# EAGLE design pedal (EAGLE 9.6.2)
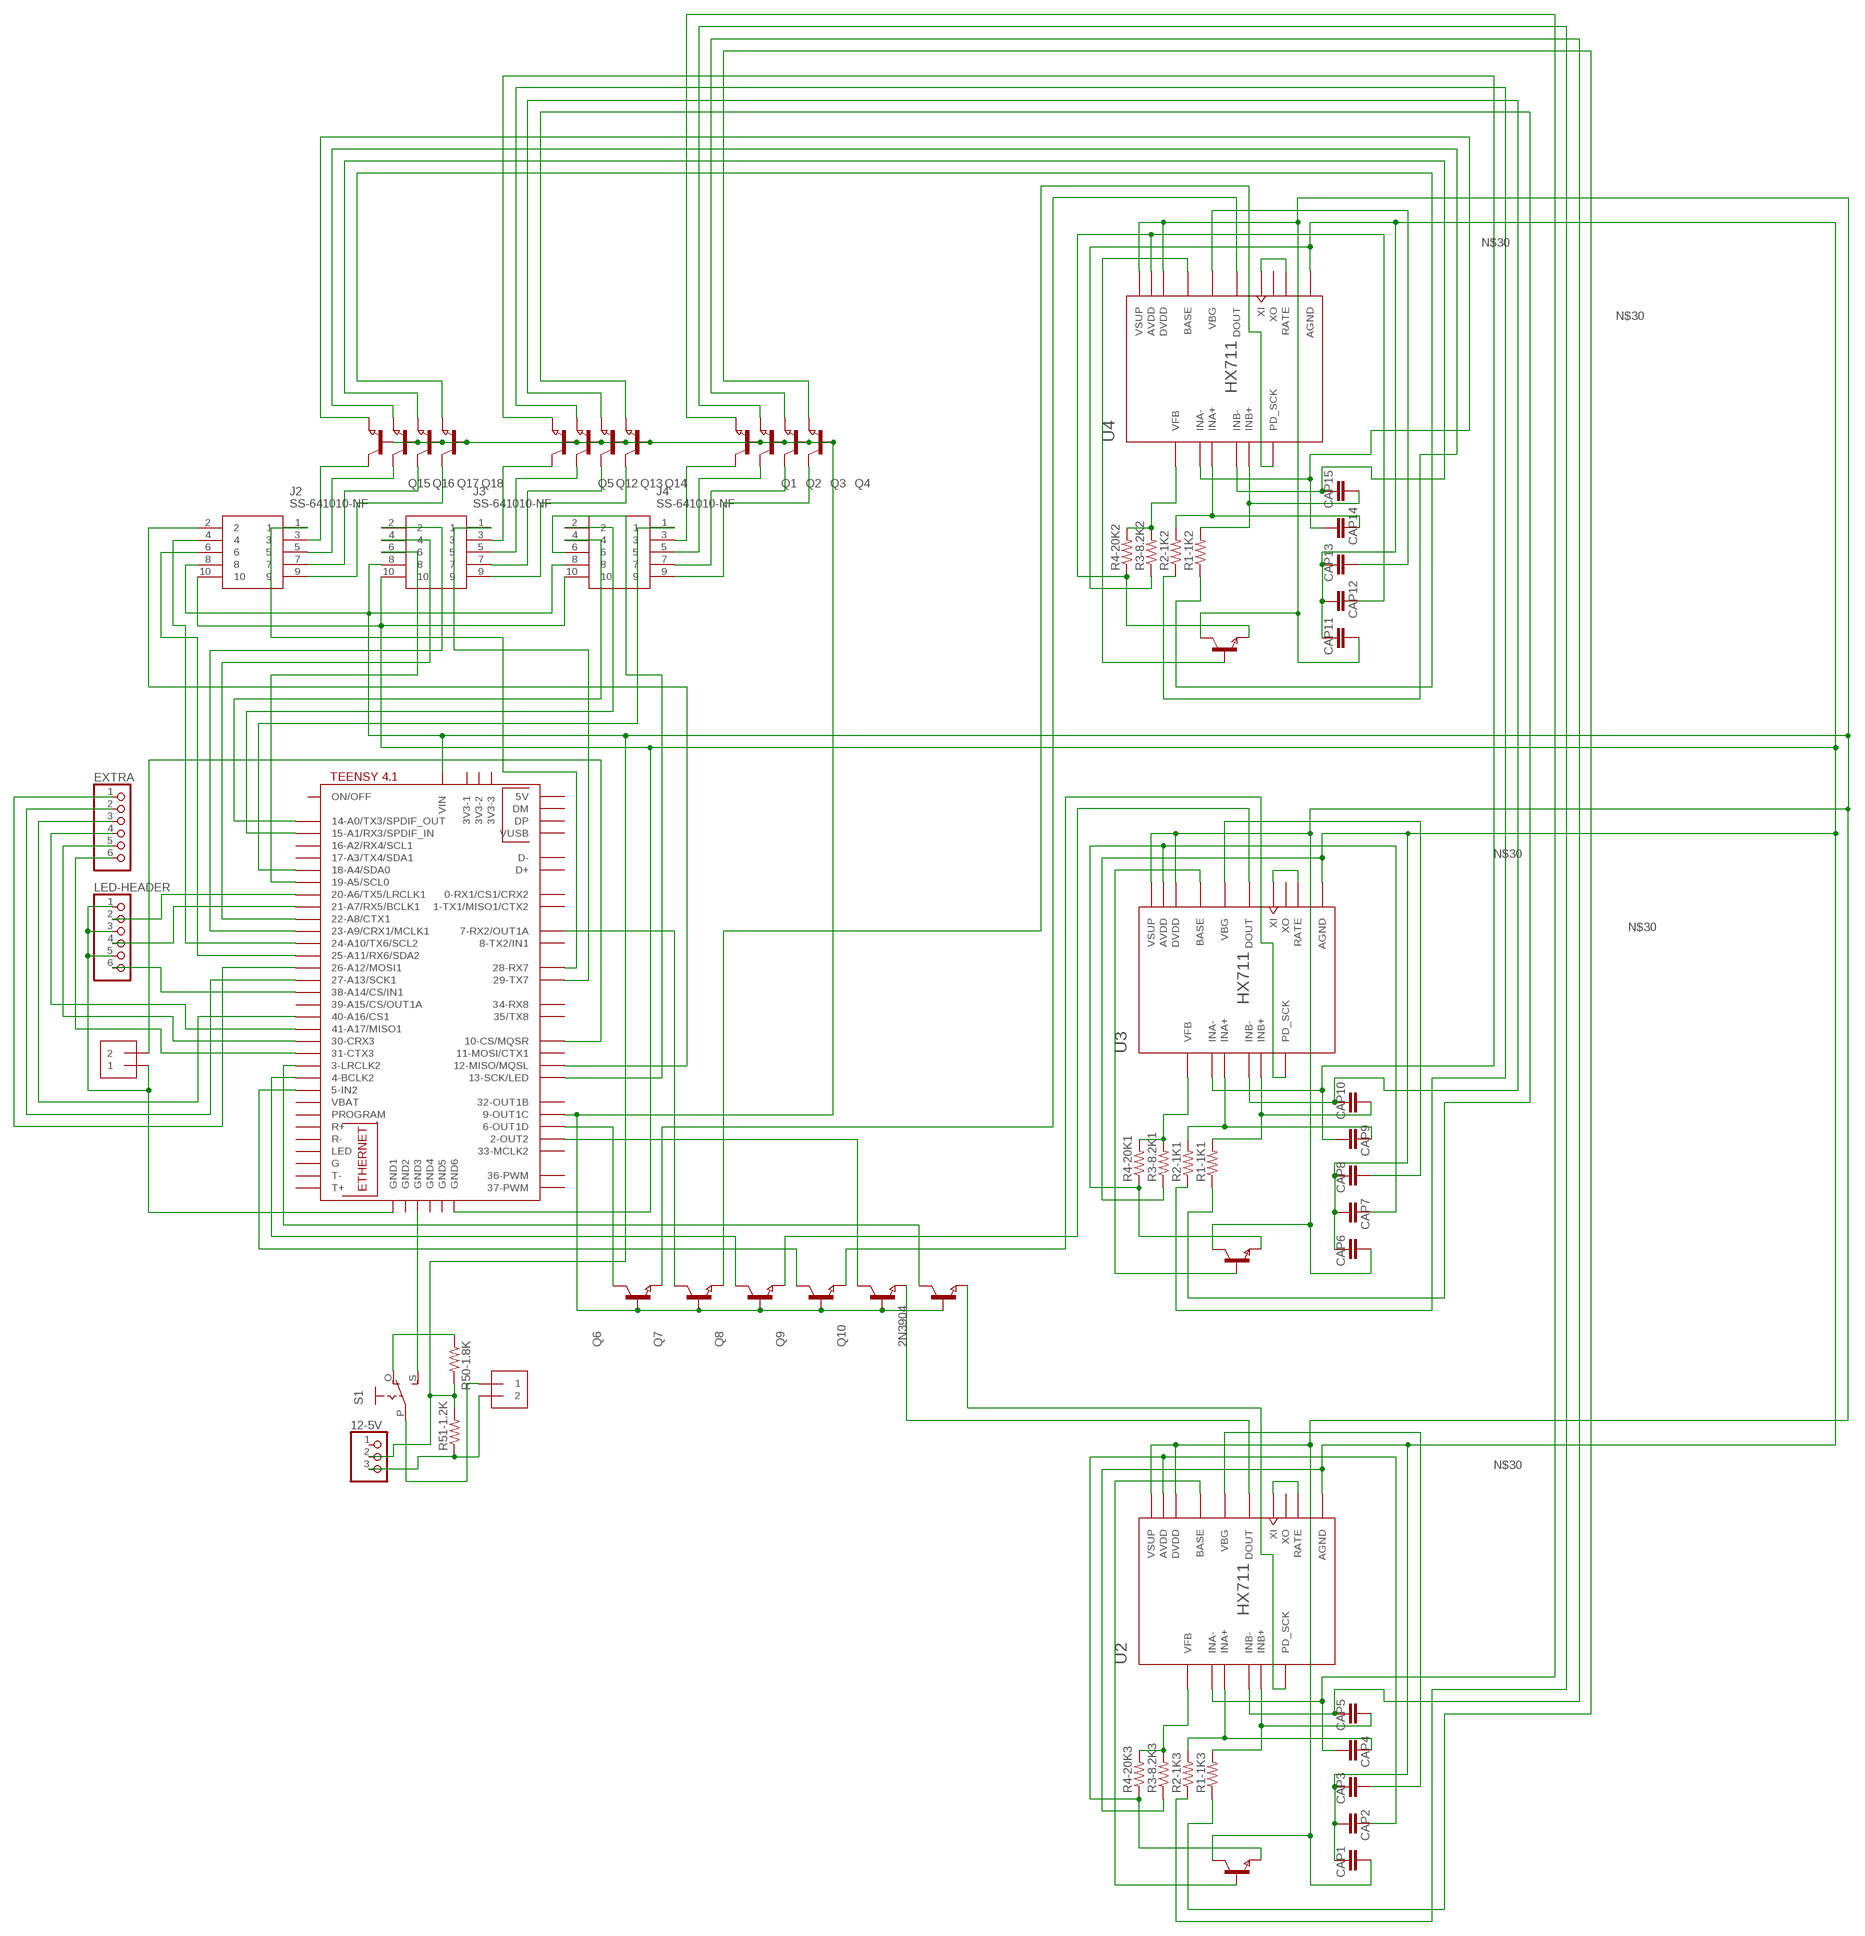
[diagram p0: schematic, sheet 1]

## Parts
2N3904  NPN-TRANSISTOR_SOT23  [SOT23]
12-5V  PINHD-1X3  [1X03]
CAP1  1uf  10NF-0603-50V-10%  [0603]
CAP2  1uf  10NF-0603-50V-10%  [0603]
CAP3  1uf  10NF-0603-50V-10%  [0603]
CAP4  .1uf  10NF-0603-50V-10%  [0603]
CAP5  .1uf  10NF-0603-50V-10%  [0603]
CAP6  1uf  10NF-0603-50V-10%  [0603]
CAP7  1uf  10NF-0603-50V-10%  [0603]
CAP8  1uf  10NF-0603-50V-10%  [0603]
CAP9  .1uf  10NF-0603-50V-10%  [0603]
CAP10  .1uf  10NF-0603-50V-10%  [0603]
CAP11  1uf  10NF-0603-50V-10%  [0603]
CAP12  1uf  10NF-0603-50V-10%  [0603]
CAP13  1uf  10NF-0603-50V-10%  [0603]
CAP14  .1uf  10NF-0603-50V-10%  [0603]
CAP15  .1uf  10NF-0603-50V-10%  [0603]
E-STOP  1X2-3.5MM  [1X2-3.5MM]
EXTRA  PINHD-1X6B  [1X06-BIG]
J2  SS-641010-NF  [SS-641010-NF]
J3  SS-641010-NF  [SS-641010-NF]
J4  SS-641010-NF  [SS-641010-NF]
LED-HEADER  PINHD-1X6B  [1X06-BIG]
POWER-IN  1X2-3.5MM  [1X2-3.5MM]
Q1  NPN-TRANSISTOR_SOT23  [SOT23]
Q2  NPN-TRANSISTOR_SOT23  [SOT23]
Q3  NPN-TRANSISTOR_SOT23  [SOT23]
Q4  NPN-TRANSISTOR_SOT23  [SOT23]
Q5  NPN-TRANSISTOR_SOT23  [SOT23]
Q6  NPN-TRANSISTOR_SOT23  [SOT23]
Q7  NPN-TRANSISTOR_SOT23  [SOT23]
Q8  NPN-TRANSISTOR_SOT23  [SOT23]
Q9  NPN-TRANSISTOR_SOT23  [SOT23]
Q10  NPN-TRANSISTOR_SOT23  [SOT23]
Q12  NPN-TRANSISTOR_SOT23  [SOT23]
Q13  NPN-TRANSISTOR_SOT23  [SOT23]
Q14  NPN-TRANSISTOR_SOT23  [SOT23]
Q15  NPN-TRANSISTOR_SOT23  [SOT23]
Q16  NPN-TRANSISTOR_SOT23  [SOT23]
Q17  NPN-TRANSISTOR_SOT23  [SOT23]
Q18  NPN-TRANSISTOR_SOT23  [SOT23]
R1-1K1  R-US_R0603  [R0603]
R1-1K2  R-US_R0603  [R0603]
R1-1K3  R-US_R0603  [R0603]
R2-1K1  R-US_R0603  [R0603]
R2-1K2  R-US_R0603  [R0603]
R2-1K3  R-US_R0603  [R0603]
R3-8.2K1  R-US_R0603  [R0603]
R3-8.2K2  R-US_R0603  [R0603]
R3-8.2K3  R-US_R0603  [R0603]
R4-20K1  R-US_R0603  [R0603]
R4-20K2  R-US_R0603  [R0603]
R4-20K3  R-US_R0603  [R0603]
R50-1.8K  R-US_R0603  [R0603]
R51-1.2K  R-US_R0603  [R0603]
S1  EG1218S  [EG1218]
T1  8550  FMMT451  [SOT-23]
T2  8550  FMMT451  [SOT-23]
T3  8550  FMMT451  [SOT-23]
U2  HX711  [SOP127P600X180-16N]
U3  HX711  [SOP127P600X180-16N]
U4  HX711  [SOP127P600X180-16N]
U$5  TEENSY41  [TEENSY41]

## Nets
N$1: CAP5.2 R1-1K3.2 U2.10(INB+)
N$2: CAP10.2 R1-1K1.2 U3.10(INB+)
N$3: CAP5.1 Q3.2(E) U2.9(INB-)
N$4: Q4.2(E) R1-1K3.1
N$5: CAP4.2 R2-1K3.2 U2.8(INA+)
N$6: 2N3904.1(B) Q1.1(B) Q2.1(B) Q3.1(B) Q4.1(B) Q5.1(B) Q6.1(B) Q7.1(B) Q8.1(B) Q9.1(B) Q10.1(B) Q12.1(B) Q13.1(B) Q14.1(B) Q15.1(B) Q16.1(B) Q17.1(B) Q18.1(B) U$5.9-OUT1C
N$7: Q2.2(E) R2-1K3.1
N$8: CAP3.2 U2.6(VBG)
N$9: R3-8.2K3.2 R4-20K3.2 U2.4(VFB)
N$10: 2N3904.2(E) U2.11(PD_SCK)
N$11: T1.3(B) U2.2(BASE)
N$12: U2.14(XI) U2.15(RATE)
N$13: Q10.2(E) U2.12(DOUT)
N$14: CAP10.1 Q13.2(E) U3.9(INB-)
N$15: Q14.2(E) R1-1K1.1
N$16: CAP2.2 R4-20K3.1 T1.2(E) U2.3(AVDD)
N$17: Q10.3(C) U$5.2-OUT2
N$18: 2N3904.3(C) U$5.3-LRCLK2
N$19: CAP9.2 R2-1K1.2 U3.8(INA+)
N$20: Q12.2(E) R2-1K1.1
N$21: CAP8.2 U3.6(VBG)
N$22: R3-8.2K1.2 R4-20K1.2 U3.4(VFB)
N$23: T2.3(B) U3.2(BASE)
N$24: U3.14(XI) U3.15(RATE)
N$25: Q9.3(C) U$5.5-IN2
N$26: CAP7.2 R4-20K1.1 T2.2(E) U3.3(AVDD)
N$27: Q8.2(E) U3.12(DOUT)
N$28: Q9.2(E) U3.11(PD_SCK)
N$29: Q7.3(C) U$5.7-RX2/OUT1A
N$30: CAP1.1 CAP2.1 CAP3.1 CAP6.1 CAP7.1 CAP8.1 CAP11.1 CAP12.1 CAP13.1 J2.10 J3.10 J4.10 R3-8.2K1.1 R3-8.2K2.1 R3-8.2K3.1 U2.5(AGND) U3.5(AGND) U4.5(AGND) U$5.GND6
N$31: Q8.3(C) U$5.4-BCLK2
N$32: CAP9.1 Q5.2(E) U3.7(INA-)
N$33: Q6.3(C) U$5.6-OUT1D
N$34: CAP4.1 Q1.2(E) U2.7(INA-)
N$35: E-STOP.2 U$5.10-CS\MQSR(10-CS/MQSR)
N$36: J4.6 U$5.13-SCK/LED
N$37: E-STOP.1 LED-HEADER.1 LED-HEADER.3 LED-HEADER.5 U$5.GND1
N$38: LED-HEADER.2 U$5.20-A6/TX5/LRCLK1
N$39: 12-5V.2 CAP1.2 CAP6.2 CAP11.2 J2.8 J3.8 J4.8 R50-1.8K.2 R51-1.2K.2 T1.1(C) T2.1(C) T3.1(C) U2.1(VSUP) U2.16(DVDD) U3.1(VSUP) U3.16(DVDD) U4.1(VSUP) U4.16(DVDD) U$5.VIN
N$40: LED-HEADER.4 U$5.21-A7/RX5/BCLK1
N$41: LED-HEADER.6 U$5.38-A14/CS/IN1
N$42: J4.4 U$5.14-A0/TX3/SPDIF_OUT
N$43: J4.2 U$5.15-A1/RX3/SPDIF_IN
N$44: J4.1 U$5.18-A4/SDA0
N$45: J3.6 U$5.19-A5/SCL0
N$46: J3.4 U$5.22-A8/CTX1
N$47: J3.2 U$5.23-A9/CRX1/MCLK1
N$48: J3.1 U$5.29-TX7
N$49: EXTRA.6 U$5.31-CTX3
N$50: CAP15.2 R1-1K2.2 U4.10(INB+)
N$51: CAP15.1 Q17.2(E) U4.9(INB-)
N$52: POWER-IN.1 S1.P
N$53: S1.S U$5.GND3
N$54: 12-5V.3 POWER-IN.2 R51-1.2K.1
N$55: Q18.2(E) R1-1K2.1
N$56: J2.1 U$5.28-RX7
N$57: R50-1.8K.1 S1.O
N$58: CAP14.2 R2-1K2.2 U4.8(INA+)
N$59: J2.6 U$5.25-A11/RX6/SDA2
N$60: J2.4 U$5.24-A10/TX6/SCL2
N$61: Q16.2(E) R2-1K2.1
N$62: EXTRA.5 U$5.30-CRX3
N$63: J2.2 U$5.12-MISO/MQSL
N$64: CAP13.2 U4.6(VBG)
N$65: R3-8.2K2.2 R4-20K2.2 U4.4(VFB)
N$66: T3.3(B) U4.2(BASE)
N$67: U4.14(XI) U4.15(RATE)
N$68: CAP12.2 R4-20K2.1 T3.2(E) U4.3(AVDD)
N$69: Q6.2(E) U4.12(DOUT)
N$70: Q7.2(E) U4.11(PD_SCK)
N$71: EXTRA.4 U$5.41-A17/MISO1
N$72: EXTRA.3 U$5.40-A16/CS1
N$73: EXTRA.2 U$5.27-A13/SCK1
N$74: CAP14.1 Q15.2(E) U4.7(INA-)
N$75: EXTRA.1 U$5.26-A12/MOSI1
N$76: J2.7 Q17.3(C)
N$77: J2.5 Q16.3(C)
N$78: J2.3 Q15.3(C)
N$79: J3.7 Q13.3(C)
N$80: J3.5 Q12.3(C)
N$81: J2.9 Q18.3(C)
N$82: J3.3 Q5.3(C)
N$83: J4.7 Q3.3(C)
N$84: J4.5 Q2.3(C)
N$85: J4.3 Q1.3(C)
N$86: J3.9 Q14.3(C)
N$90: J4.9 Q4.3(C)
Unconnected: 12-5V.1 U2.13(XO) U3.13(XO) U4.13(XO) U$5.0-RX1/CS1/CRX2 U$5.1-TX1/MISO1/CTX2 U$5.3V3-1 U$5.3V3-2 U$5.3V3-3 U$5.8-TX2/IN1 U$5.11-MOSI/CTX1 U$5.16-A2/RX4/SCL1 U$5.17-A3/TX4/SDA1 U$5.32-OUT1B U$5.33-MCLK2 U$5.34-RX8 U$5.35-TX8(35/TX8) U$5.36-PWM U$5.37-PWM U$5.39-A15/CS/OUT1A U$5.+5V(5V) U$5.D+ U$5.D- U$5.DM U$5.DP U$5.G U$5.GND2 U$5.GND4 U$5.GND5 U$5.LED U$5.ON/OFF U$5.PROGRAM U$5.R+ U$5.R- U$5.T+ U$5.T- U$5.VBAT U$5.VUSB

## Library data of the parts
2N3904 Q1-Q10 Q12-Q18 = semicon-smd-ipc:NPN-TRANSISTOR_: NPN TRANSISTOR
12-5V = adafruit:PINHD-1X3: PIN HEADER
CAP1-CAP15 = SparkFun-Capacitors:10NF: 0.01uF/10nF/10,000pF ceramic capacitors A capacitor is a passive two-terminal electrical component used to store electrical energy temporarily in an electric field. CAP-09321; PROD_ID: CAP-00867; VALUE: 10nF
E-STOP POWER-IN = adafruit:1X2: 3.5mm Terminal block http://www.ladyada.net/library/pcb/eaglelibrary.html
EXTRA LED-HEADER = adafruit:PINHD-1X6: PIN HEADER
J2-J4 = SS-641010-NF:SS-641010-NF: Bel-Stewart 10P10C Right Angle RJ50 Connector, Through Hole Source: Datasheet <http://uk.rs-online.com/web/p/products/0442735>; ARROW_PART_NUMBER: SS-641010-NF; ARROW_PRICE-STOCK: https://www.arrow.com/en/products/ss-641010-nf/stewart-connector-systems?region=europe; DESCRIPTION: Bel-Stewart 10P10C Right Angle RJ50 Connector, Through Hole; HEIGHT: mm; MANUFACTURER_NAME: BelFuse; MANUFACTURER_PART_NUMBER: SS-641010-NF; MOUSER_PART_NUMBER: 530-SS-641010-NF; MOUSER_PRICE-STOCK: https://www.mouser.co.uk/ProductDetail/Stewart-Connector-Bel/SS-641010-NF?qs=SRYZG9HaIQ29Bv5DHkwVpw%3D%3D
R1-1K1-R1-1K3 R2-1K1-R2-1K3 R3-8.2K1-R3-8.2K3 R4-20K1-R4-20K3 R50-1.8K R51-1.2K = adafruit:R-US_: RESISTOR, American symbol
S1 = adafruit:EG1218: SLIDING SWITCH 0.1" spacing through hole, vertical SPDT slide switch http://www.ladyada.net/library/pcb/eaglelibrary.html
T1-T3 = zetex:FMMT451: NPN TRANSISTOR; OC_FARNELL: unknown; OC_NEWARK: unknown
U2-U4 = HX711 (1):HX711: Check availability <https://pricing.snapeda.com/parts/HX711/AVIA%20SEMICONDUCTOR/view-part?ref=eda>; AVAILABILITY: Not in stock; CHECK_PRICES: https://www.snapeda.com/parts/HX711/AVIA+SEMICONDUCTOR/view-part/?ref=eda; DESCRIPTION: Precision 24-bit analog-to-digital converter (ADC) designed for weigh scales and industrial control applications to interface directly with a bridge sensor.; MF: AVIA SEMICONDUCTOR; MP: HX711; PACKAGE: None; PRICE: None; SNAPEDA_LINK: https://www.snapeda.com/parts/HX711/AVIA+SEMICONDUCTOR/view-part/?ref=snap
U$5 = teensy:TEENSY41

## Net classes
1 EMMC: width 0.064 mm, drill 0.01 mm, clearance 0.005 mm
2 PCB: width 0.254 mm, drill 0.01 mm, clearance 0.005 mm

## Board
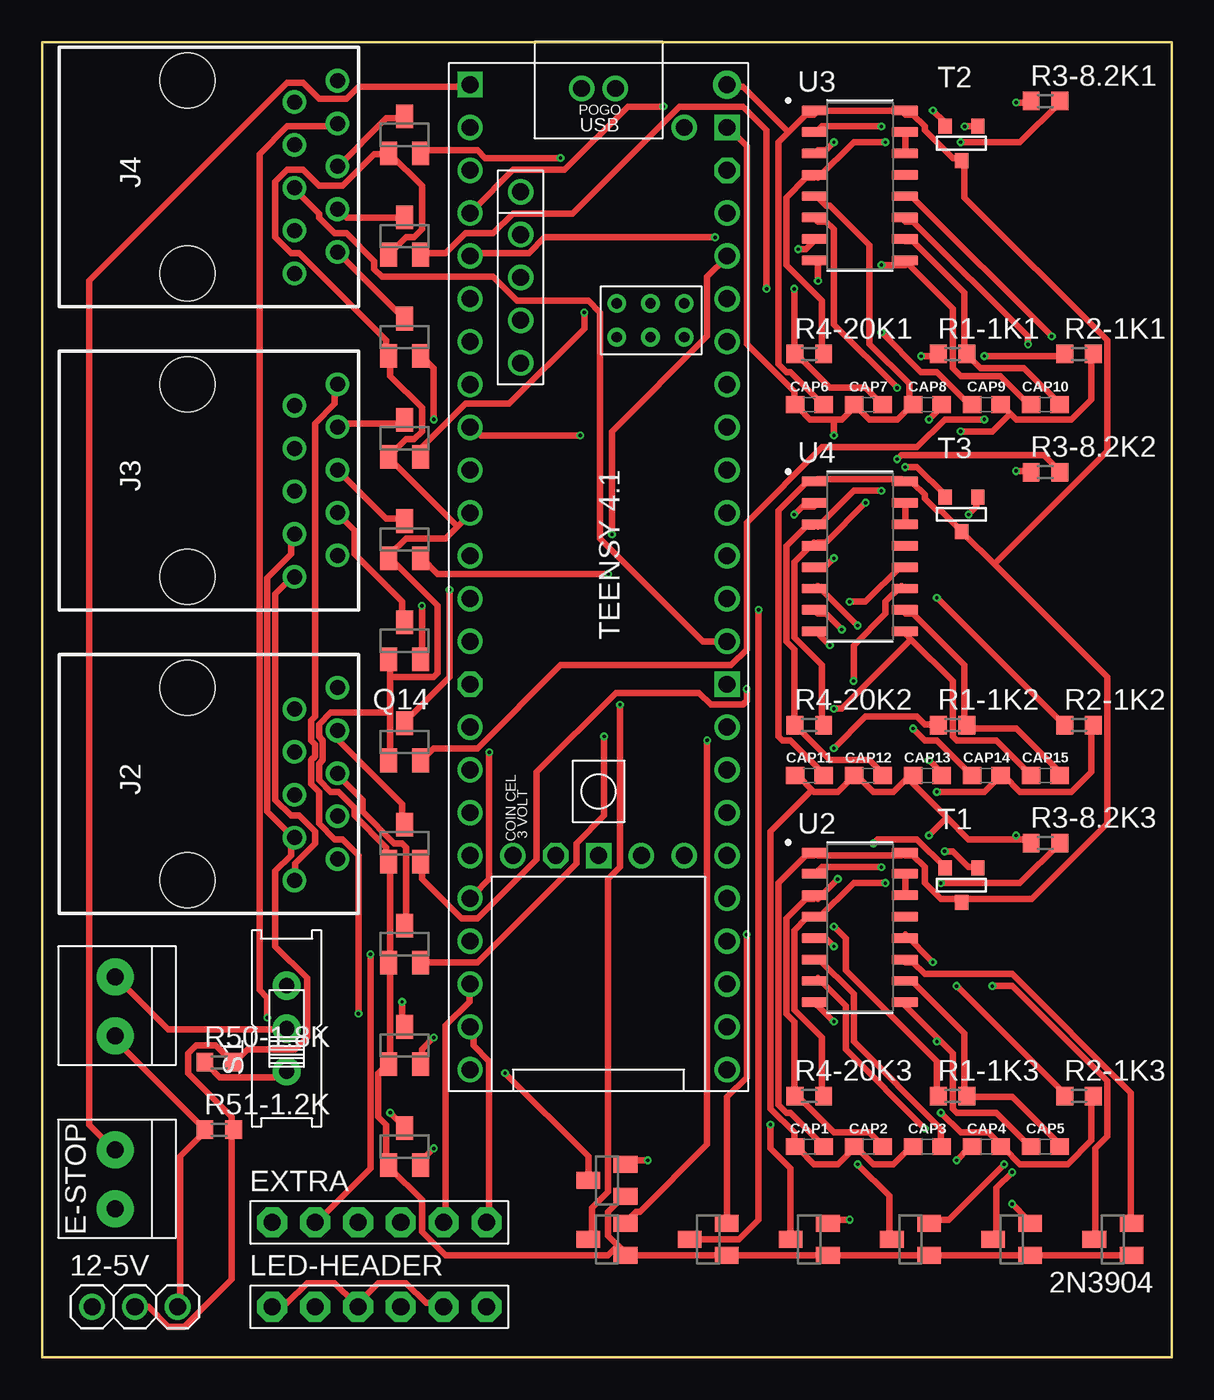
[diagram p1: board, top side]
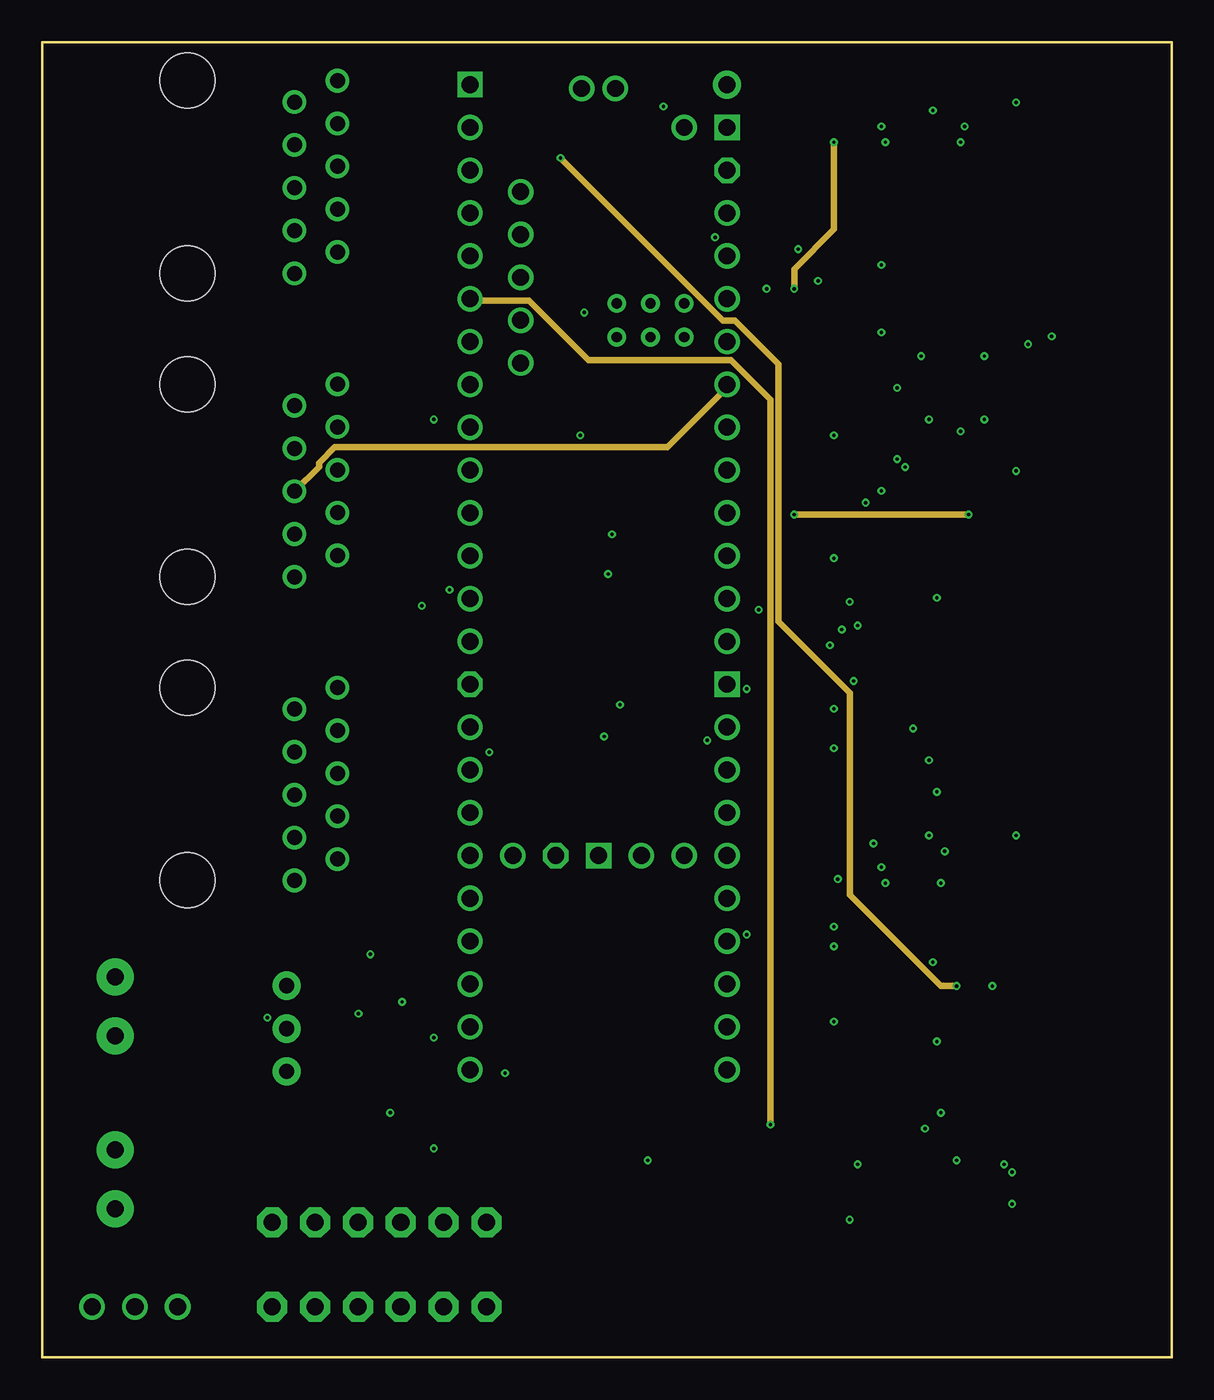
[diagram p2: board, inner layer Route2]
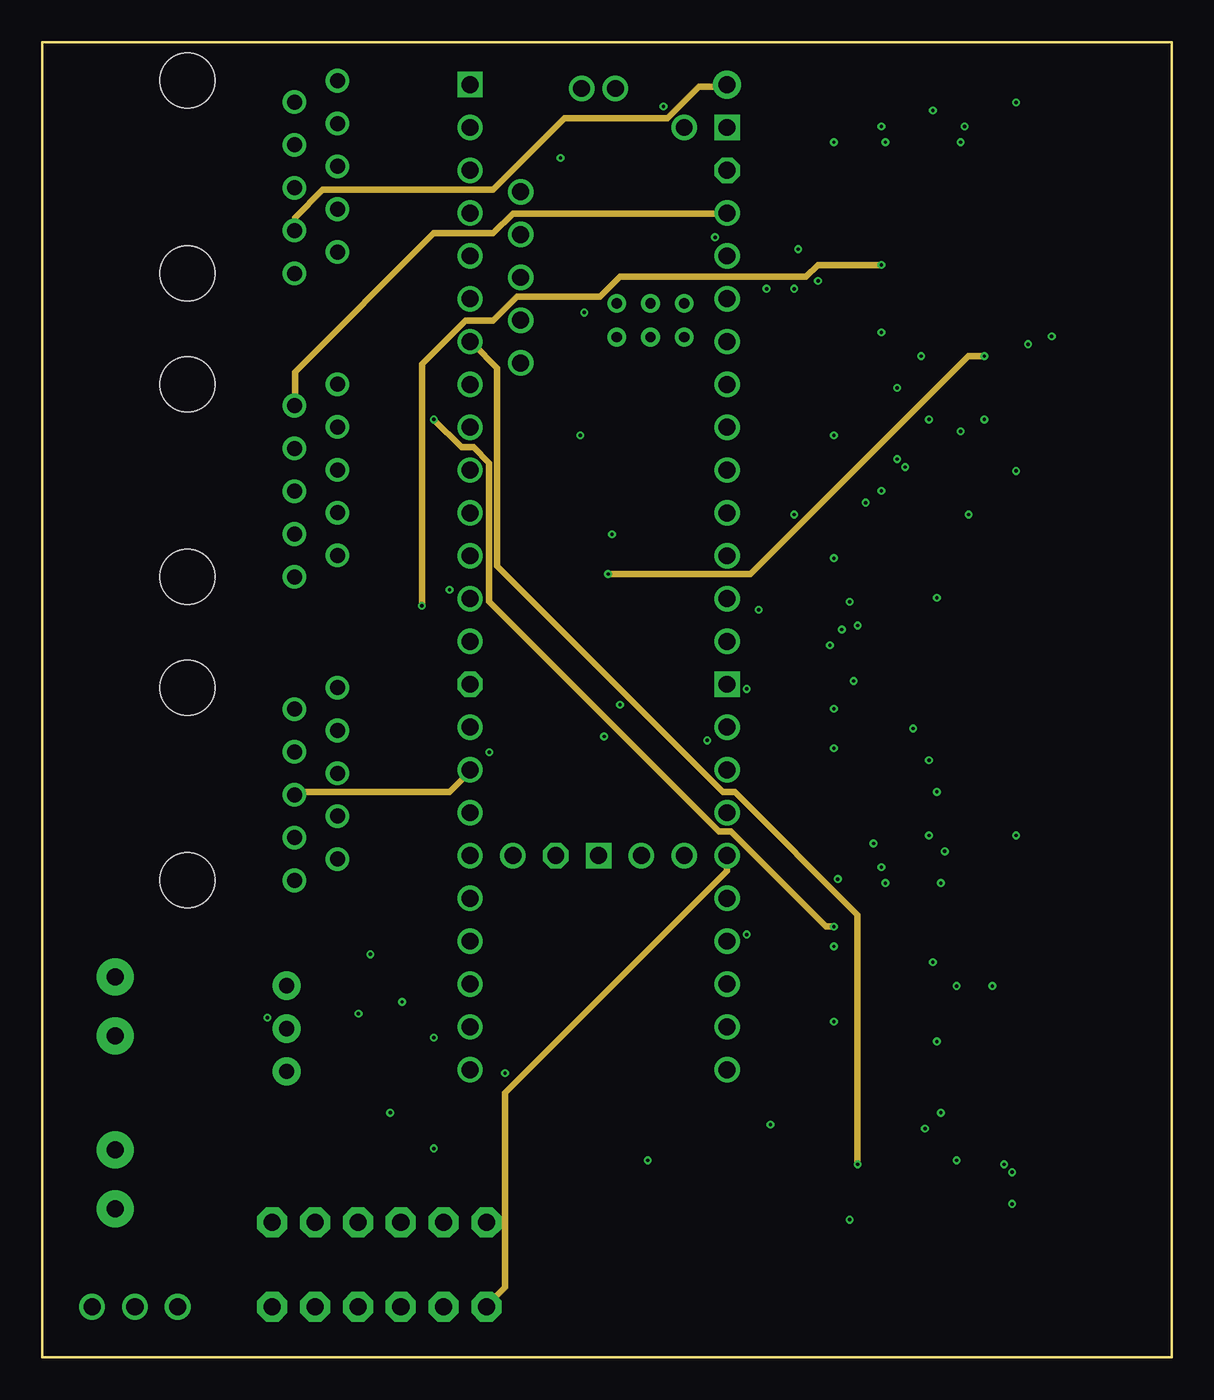
[diagram p3: board, inner layer Route15]
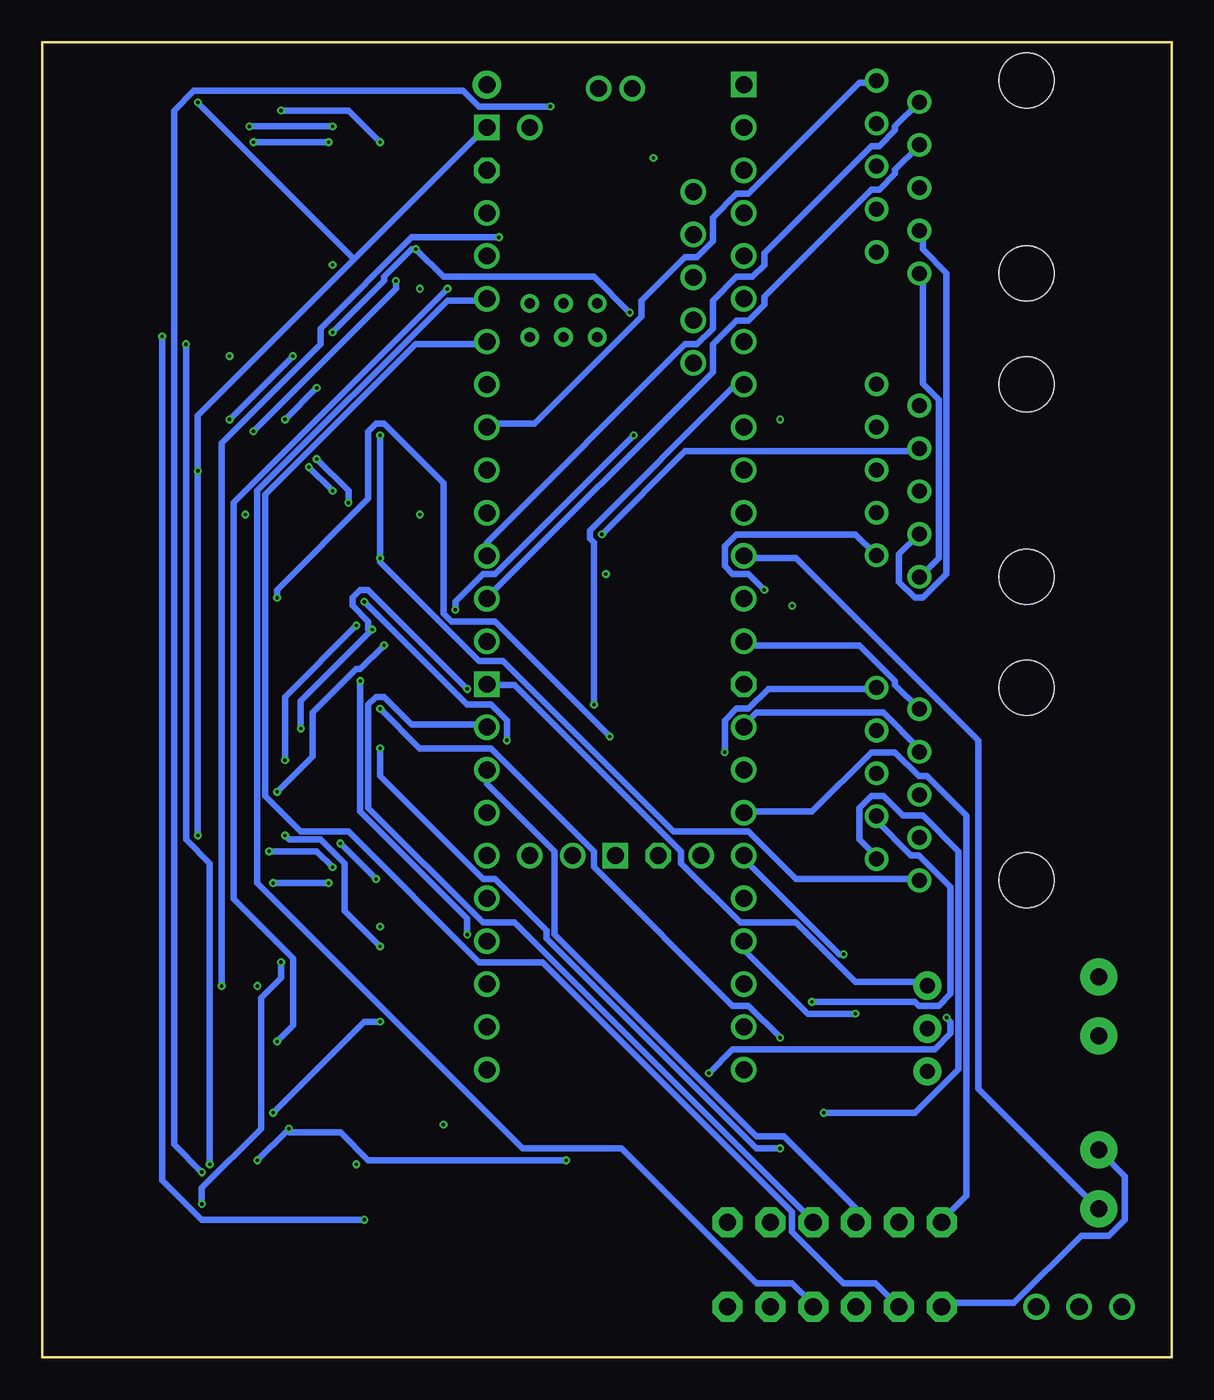
[diagram p4: board, bottom side, seen from below]

Size 67 x 78 mm. Coordinates in mm from the lower left corner, seen from the top.
Outline: 67,0 0,0 0,78 67,78 67,0
Copper layers (1+2*15+16): Top 0.035mm / dielectric 1.5mm / Route2 0.035mm / dielectric 0.15mm / Route15 0.035mm / dielectric 0.2mm / Bottom 0.035mm
Design rules "default *": minimum track width 15mil, minimum drill 0.2mm, track to track 3.5mil, track to pad 5mil, pad to pad 0.2mm, via to via 6mil, smd to smd 6mil, copper to edge 40mil, drill to drill 6mil, minimum pad ring 10mil, minimum via ring 0.13mm, stop-mask expansion 4mil, vias tented up to drill 0mil, thermal gap 10mil

### Footprints (pad centres in the part's own frame; a part is rotated, then mirrored left to right if it is on the bottom)
SOT23 = smd 1 x 1.4: 1 -0.95,-1.1; 2 0.95,-1.1; 3 0,1.1
1X03 = drill 1.016: 1 -2.54,0; 2 0,0; 3 2.54,0
0603 = smd 1.1 x 1: 1 -0.85,0; 2 0.85,0
1X2-3.5MM = drill 1 pad 2.184: 1 1.8,0; 2 -1.7,0
1X06-BIG = drill 1.016 pad 1.778 octagon: 1 -6.35,0; 2 -3.81,0; 3 -1.27,0; 4 1.27,0; 5 3.81,0; 6 6.35,0
SS-641010-NF = drill 0.89 pad 1.39: 1 -5.715,16.51; 2 -4.445,13.97; 3 -3.175,16.51; 4 -1.905,13.97; 5 -0.635,16.51; 6 0.635,13.97; 7 1.905,16.51; 8 3.175,13.97; 9 4.445,16.51; 10 5.715,13.97 | hole 3.25: 5.715,7.62; -5.715,7.62
R0603 = smd 1 x 1.1: 1 -0.85,0; 2 0.85,0
EG1218 = drill 0.9 pad 1.676: O -2.54,0; P 0,0; S 2.54,0
SOT-23 = smd 0.787 x 0.889: 1 0.025,-1.016; 2 -0.94,1.016; 3 0.991,1.016
SOP127P600X180-16N = smd 1.58 x 0.59: 1 -2.67,4.445; 2 -2.67,3.175; 3 -2.67,1.905; 4 -2.67,0.635; 5 -2.67,-0.635; 6 -2.67,-1.905; 7 -2.67,-3.175; 8 -2.67,-4.445; 9 2.67,-4.445; 10 2.67,-3.175; 11 2.67,-1.905; 12 2.67,-0.635; 13 2.67,0.635; 14 2.67,1.905; 15 2.67,3.175; 16 2.67,4.445
TEENSY41 = drill 1: 0-RX1/CS1/CRX2 -27.94,-7.62; 1-TX1/MISO1/CTX2 -25.4,-7.62; 2-OUT2 -22.86,-7.62; 3-LRCLK2 -20.32,-7.62; 4-BCLK2 -17.78,-7.62; 5-IN2 -15.24,-7.62; 6-OUT1D -12.7,-7.62; 7-RX2/OUT1A -10.16,-7.62; 8-TX2/IN1 -7.62,-7.62; 9-OUT1C -5.08,-7.62; 10-CS\MQSR -2.54,-7.62; 11-MOSI/CTX1 0,-7.62; 12-MISO/MQSL 2.54,-7.62; 13-SCK/LED 2.54,7.62; 14-A0/TX3/SPDIF_OUT 0,7.62; 15-A1/RX3/SPDIF_IN -2.54,7.62; 16-A2/RX4/SCL1 -5.08,7.62; 17-A3/TX4/SDA1 -7.62,7.62; 18-A4/SDA0 -10.16,7.62; 19-A5/SCL0 -12.7,7.62; 20-A6/TX5/LRCLK1 -15.24,7.62; 21-A7/RX5/BCLK1 -17.78,7.62; 22-A8/CTX1 -20.32,7.62; 23-A9/CRX1/MCLK1 -22.86,7.62; 24-A10/TX6/SCL2 7.62,-7.62; 25-A11/RX6/SDA2 10.16,-7.62; 26-A12/MOSI1 12.7,-7.62; 27-A13/SCK1 15.24,-7.62; 28-RX7 17.78,-7.62; 29-TX7 20.32,-7.62; 30-CRX3 22.86,-7.62; 31-CTX3 25.4,-7.62; 32-OUT1B 27.94,-7.62; 33-MCLK2 27.94,7.62; 34-RX8 25.4,7.62; 35-TX8 22.86,7.62; 36-PWM 20.32,7.62; 37-PWM 17.78,7.62; 38-A14/CS/IN1 15.24,7.62; 39-A15/CS/OUT1A 12.7,7.62; 40-A16/CS1 10.16,7.62; 41-A17/MISO1 7.62,7.62; +5V -24.13,-4.62; D+ -30.25,-1; D- -30.25,1; DM -21.59,-4.62; DP -19.05,-4.62; GND4 -16.51,-4.62; GND5 -13.97,-4.62; ON/OFF 15.24,5.08; PROGRAM 15.24,2.54; VBAT 15.24,-5.08; VUSB -27.94,5.08 | drill 1 octagon: 3V3-1 5.08,-7.62; 3V3-2 15.24,-2.54; 3V3-3 -25.4,7.62 | drill 0.6: G -15.51,3.08; LED -17.51,3.08; R+ -17.51,5.08; R- -15.51,5.08; T+ -15.51,1.08; T- -17.51,1.08 | drill 1 square: GND1 -30.48,-7.62; GND2 15.24,0; GND3 5.08,7.62; GND6 -27.94,7.62 | drill 1 pad 1.676: VIN -30.48,7.62

### Placement (x,y rotation side)
2N3904  63.5,7 90 top
12-5V  5.5,3 0 top
CAP1  45.5,12.5 0 top
CAP2  49,12.5 0 top
CAP3  52.5,12.5 0 top
CAP4  56,12.5 0 top
CAP5  59.5,12.5 0 top
CAP6  45.5,56.5 0 top
CAP7  49,56.5 0 top
CAP8  52.5,56.5 0 top
CAP9  56,56.5 0 top
CAP10  59.5,56.5 0 top
CAP11  45.5,34.5 0 top
CAP12  49,34.5 0 top
CAP13  52.5,34.5 0 top
CAP14  56,34.5 0 top
CAP15  59.5,34.5 0 top
E-STOP  4.34,10.5 90 top
EXTRA  20,8 0 top
J2  1,34 270 top
J3  1,52 270 top
J4  1,70 270 top
LED-HEADER  20,3 0 top
POWER-IN  4.34,20.76 90 top
Q1  33.5,10.5 90 top
Q2  21.5,72.5 0 top
Q3  21.5,66.5 0 top
Q4  21.5,60.5 0 top
Q5  21.5,54.5 0 top
Q6  33.5,7 90 top
Q7  39.5,7 90 top
Q8  45.5,7 90 top
Q9  51.5,7 90 top
Q10  57.5,7 90 top
Q12  21.5,48.5 0 top
Q13  21.5,42.5 0 top
Q14  21.5,36.5 0 top
Q15  21.5,30.5 0 top
Q16  21.5,24.5 0 top
Q17  21.5,18.5 0 top
Q18  21.5,12.5 0 top
R1-1K1  54,59.5 0 top
R1-1K2  54,37.5 0 top
R1-1K3  54,15.5 0 top
R2-1K1  61.5,59.5 0 top
R2-1K2  61.5,37.5 0 top
R2-1K3  61.5,15.5 0 top
R3-8.2K1  59.5,74.5 0 top
R3-8.2K2  59.5,52.5 0 top
R3-8.2K3  59.5,30.5 0 top
R4-20K1  45.5,59.5 0 top
R4-20K2  45.5,37.5 0 top
R4-20K3  45.5,15.5 0 top
R50-1.8K  10.5,17.5 0 top
R51-1.2K  10.5,13.5 0 top
S1  14.5,19.5 90 top
T1  54.5,28 0 top
T2  54.5,72 0 top
T3  54.5,50 0 top
U2  48.5,25.5 0 top
U3  48.5,69.5 0 top
U4  48.5,47.5 0 top
U$5  33,45 270 top

### Tracks (layer width: path | path; a pad name or v marks a point on that pad's centre or on a via)
N$1
  Top 0.381: CAP5.2 60.35,12.62 57.53,15.44 54.94,15.44 R1-1K3.2 54.71,15.68 54.71,19.2 51.66,22.26 51.19,22.26 U2.10
N$2
  Top 0.381: CAP10.2 60.35,56.56 58.23,58.67 55.65,58.67 54.94,59.38 R1-1K1.2 54.71,59.62 54.71,63.14 51.66,66.19 51.19,66.19 U3.10
N$3  (via drill 0.2)
  Top 0.381: 53.18,18.85 51.19,20.85 U2.9 | 53.18,18.85 54,18.03 54,14.74 54.24,14.5 56.59,14.5 58.47,12.62 CAP5.1 | v42.96,63.37 42.96,72.77 41.55,74.18 37.79,74.18 31.45,67.84 27.93,67.84 26.75,66.66 25.11,66.66 23.93,65.49 22.52,65.49 Q3.2 | v53.06,18.73 53.18,18.85
  Bottom 0.381: v42.96,63.37 55.65,50.69 55.65,27.19 52.13,23.67 52.13,19.67 v53.06,18.73
N$4  (via drill 0.2)
  Top 0.381: v46.96,25.55 47.66,24.84 47.66,22.96 53.06,17.56 53.06,15.68 R1-1K3.1 | v23.23,55.62 23.23,58.67 22.52,59.38 Q4.2
  Route15 0.381: v46.96,25.55 46.49,25.55 40.85,31.19 40.14,31.19 26.52,44.81 26.52,53.04 25.58,53.98 24.87,53.98 v23.23,55.62
N$5  (via drill 0.2)
  Top 0.381: R2-1K3.2 62.23,15.44 62.23,12.86 60.82,11.45 58,11.45 57.06,12.39 CAP4.2 56.83,12.62 56.12,13.33 54.47,13.33 v53.3,14.5 | v46.96,19.91 46.02,20.85 U2.8
  Bottom 0.381: v46.96,19.91 47.9,19.91 v53.3,14.5
N$6
  Top 0.381: Q6.1 34.5,6.28 33.56,7.22 33.56,8.63 34.5,9.57 Q1.1 | Q6.1 34.74,6.05 40.38,6.05 Q7.1 40.61,6.05 46.49,6.05 Q8.1 46.72,6.05 Q9.1 52.83,6.05 58.47,6.05 Q10.1 58.7,6.05 64.58,6.05 2N3904.1 | Q3.1 20.64,65.49 21.58,66.43 22.05,66.43 22.52,66.9 22.52,69.48 20.64,71.36 Q2.1 20.41,71.36 19.7,71.36 17.82,69.48 16.41,69.48 15.47,70.42 14.53,70.42 13.83,69.72 13.83,66.43 14.77,65.49 15.24,65.49 20.41,60.32 20.41,59.62 Q4.1 20.64,59.38 20.64,58.2 22.52,56.33 22.52,54.92 22.05,54.45 21.58,54.45 20.64,53.51 Q5.1 20.64,53.27 24.64,49.28 | 20.64,40.35 20.64,41.29 Q13.1 | 20.64,40.35 20.64,38.23 | 20.64,38.23 20.64,35.41 Q14.1 | 24.64,49.28 25.34,49.98 U$5.9-OUT1C | 24.64,49.28 23.93,48.57 21.58,48.57 20.64,47.63 Q12.1 20.64,47.4 23.46,44.58 23.46,40.58 23.23,40.35 20.64,40.35 | 20.64,38.23 17.12,38.23 16.41,37.53 16.41,36.82 16.65,36.59 16.65,35.41 16.41,35.18 16.41,34.24 17.12,33.53 17.59,33.53 18.53,32.59 18.53,32.12 20.41,30.25 20.41,29.54 Q15.1 20.64,29.31 20.64,23.43 Q16.1 20.64,23.2 20.64,17.56 Q17.1 20.41,17.32 19.94,16.85 19.94,14.27 20.41,13.8 20.41,11.45 Q18.1 20.64,11.22 22.52,9.34 22.52,7.46 23.93,6.05 33.56,6.05 34.03,6.52 Q6.1
N$7  (via drill 0.2)
  Top 0.381: v54.24,22.02 60.58,15.68 R2-1K3.1 | v30.75,71.13 26.28,71.13 25.81,71.6 22.52,71.6 Q2.2
  Route2 0.381: v54.24,22.02 53.3,22.02 47.9,27.43 47.9,39.41 43.67,43.64 43.67,58.91 41.08,61.49 40.38,61.49 v30.75,71.13
N$8
  Top 0.381: CAP3.2 53.3,12.62 53.3,13.56 48.13,18.73 48.13,21.55 46.02,23.67 U2.6
N$9  (via drill 0.2)
  Top 0.381: R4-20K3.2 46.25,15.68 46.25,18.97 44.61,20.61 44.61,25.31 45.31,26.02 45.78,26.02 U2.4 46.02,26.02 48.13,28.13 v50.01,28.13 | v53.3,28.13 58,28.13 60.35,30.48 R3-8.2K3.2
  Bottom 0.381: v50.01,28.13 v53.3,28.13
N$10
  Top 0.381: 2N3904.2 64.58,8.16 64.58,15.68 57.53,22.73 52.36,22.73 51.66,23.43 51.19,23.43 U2.11
N$11  (via drill 0.2)
  Top 0.381: v53.53,30.01 54,30.01 54.94,29.07 55.42,29.07 T1.3 | v49.78,29.07 46.25,29.07 46.02,28.84 U2.2
  Bottom 0.381: v53.53,30.01 50.72,30.01 v49.78,29.07
N$12
  Top 0.381: U2.14 51.19,27.43 51.19,28.6 U2.15
N$13  (via drill 0.2)
  Top 0.381: v57.53,9.1 58.47,8.16 Q10.2 | v52.83,23.43 51.19,25.08 U2.12
  Bottom 0.381: v57.53,9.1 57.53,10.04 54,13.56 54,21.32 52.83,22.49 v52.83,23.43
N$14  (via drill 0.2)
  Top 0.381: CAP10.1 58.47,56.56 56.83,58.2 54.47,58.2 54,58.67 54,62.2 51.19,65.02 U3.9 51.19,64.78 v49.78,64.78 | v22.52,44.58 22.52,41.52 Q13.2
  Route15 0.381: v22.52,44.58 22.52,58.91 25.11,61.49 26.75,61.49 28.16,62.9 33.09,62.9 34.27,64.08 45.31,64.08 46.02,64.78 v49.78,64.78
N$15  (via drill 0.2)
  Top 0.381: v52.13,59.38 53.06,59.38 R1-1K1.1 | v55.89,55.62 53.53,55.62 51.89,53.98 46.25,53.98 41.79,49.51 41.79,41.99 40.85,41.05 30.75,41.05 25.81,36.12 23.23,36.12 22.52,35.41 Q14.2
  Bottom 0.381: v55.89,55.62 v52.13,59.38
N$16  (via drill 0.2)
  Top 0.381: CAP2.2 49.78,12.62 49.07,13.33 46.96,13.33 44.84,15.44 R4-20K3.1 44.61,15.68 44.61,19.91 44.14,20.38 44.14,26.02 45.31,27.19 45.78,27.19 U2.3 46.02,27.19 v47.19,28.37 | v49.31,30.48 49.54,30.72 51.89,30.72 53.53,29.07 T1.2
  Bottom 0.381: v47.19,28.37 v49.31,30.48
N$17  (via drill 0.2)
  Top 0.381: v57.53,10.98 56.59,10.04 56.59,7.22 Q10.3 | v36.85,74.18 34.74,74.18 30.98,70.42 27.93,70.42 25.58,68.07 U$5.2-OUT2
  Bottom 0.381: v57.53,10.98 59.17,12.62 59.17,73.95 58,75.12 42.02,75.12 41.08,74.18 v36.85,74.18
N$18  (via drill 0.2)
  Top 0.381: v56.36,22.02 57.53,22.02 63.17,16.38 63.17,13.09 62.46,12.39 62.46,7.22 2N3904.3 | v39.91,66.43 29.81,66.43 28.86,65.49 25.58,65.49 U$5.3-LRCLK2
  Bottom 0.381: v56.36,22.02 56.36,54.21 50.48,60.08 50.48,61.02 45.08,66.43 v39.91,66.43
N$19  (via drill 0.2)
  Top 0.381: 57.41,55.97 57.76,55.62 61.05,55.62 62.23,56.8 62.23,59.38 R2-1K1.2 | 57.41,55.97 57.06,56.33 CAP9.2 | v46.02,63.84 46.02,65.02 U3.8 | v54.47,54.92 56.36,54.92 57.41,55.97
  Bottom 0.381: v46.02,63.84 46.02,63.37 v54.47,54.92
N$20  (via drill 0.2)
  Top 0.381: v55.89,59.38 60.58,59.38 R2-1K1.1 | v33.56,46.46 23.46,46.46 22.52,47.4 Q12.2
  Route15 0.381: v55.89,59.38 54.94,59.38 42.02,46.46 v33.56,46.46
N$21  (via drill 0.2)
  Top 0.381: v52.59,55.62 53.3,56.33 CAP8.2 | v50.72,57.5 46.96,61.26 46.96,66.9 46.49,67.37 46.02,67.37 U3.6
  Bottom 0.381: v50.72,57.5 v52.59,55.62
N$22  (via drill 0.2)
  Top 0.381: R4-20K1.2 46.25,59.62 46.25,62.67 44.14,64.78 44.14,68.78 45.31,69.95 45.78,69.95 U3.4 46.02,69.95 48.13,72.07 v50.01,72.07 | v54.47,72.07 58,72.07 60.35,74.42 R3-8.2K1.2
  Bottom 0.381: v50.01,72.07 v54.47,72.07
N$23  (via drill 0.2)
  Top 0.381: v54.71,73.01 55.42,73.01 T2.3 | v49.78,73.01 46.25,73.01 46.02,72.77 U3.2
  Bottom 0.381: v49.78,73.01 v54.71,73.01
N$24
  Top 0.381: U3.14 51.19,71.6 51.19,72.54 U3.15
N$25  (via drill 0.2)
  Top 0.381: v48.37,11.45 50.25,9.57 50.25,7.22 Q9.3
  Route15 0.381: v48.37,11.45 48.37,26.25 41.08,33.53 40.38,33.53 26.99,46.93 26.99,58.67 25.58,60.08 U$5.5-IN2
N$26  (via drill 0.2)
  Top 0.381: CAP7.2 49.78,56.56 48.84,57.5 46.72,57.5 44.84,59.38 R4-20K1.1 44.61,59.62 v44.61,63.37 | v52.83,73.95 53.53,73.24 T2.2 | v46.96,72.07 46.49,71.6 46.02,71.6 U3.3
  Route2 0.381: v44.61,63.37 44.61,64.55 46.96,66.9 v46.96,72.07
  Bottom 0.381: v52.83,73.95 48.84,73.95 v46.96,72.07
N$27  (via drill 0.2)
  Top 0.381: v47.9,8.16 46.72,8.16 Q8.2 | v59.88,60.55 51.66,68.78 51.19,68.78 U3.12
  Bottom 0.381: v47.9,8.16 57.53,8.16 59.88,10.51 v59.88,60.55
N$28  (via drill 0.2)
  Top 0.381: v57.06,11.45 53.77,8.16 52.83,8.16 Q9.2 | v58.47,60.08 58.47,60.55 51.66,67.37 51.19,67.37 U3.11
  Bottom 0.381: v57.06,11.45 57.06,29.31 58.47,30.72 v58.47,60.08
N$29  (via drill 0.2)
  Top 0.381: v42.49,44.34 42.49,8.16 41.32,6.99 38.5,6.99 Q7.3 | v31.92,54.68 26.05,54.68 25.58,55.15 U$5.7-RX2/OUT1A
  Bottom 0.381: v42.49,44.34 42.49,44.81 40.85,46.46 40.14,46.46 v31.92,54.68
N$30  (via drill 0.2)
  Top 0.381: J2.10 15,28.37 15,29.31 16.18,30.48 16.18,31.19 15.24,32.12 14.77,32.12 13.83,33.06 13.83,45.28 14.77,46.22 J3.10 | CAP3.1 51.42,12.39 50.48,11.45 49.31,11.45 48.37,12.39 CAP2.1 48.13,12.39 47.19,11.45 45.78,11.45 44.84,12.39 CAP1.1 44.61,12.62 44.61,13.33 43.2,14.74 43.2,31.19 45.66,33.65 | 45.66,33.65 45.78,33.53 47.19,33.53 48.13,34.48 CAP12.1 48.37,34.48 49.31,33.53 50.48,33.53 51.42,34.48 CAP13.1 51.42,34.24 53.65,32.01 | 45.66,33.65 44.84,34.48 CAP11.1 | 57.76,30.72 54.94,30.72 53.65,32.01 | 57.76,30.72 58.47,30.72 R3-8.2K3.1 | v46.96,24.37 46.49,24.84 46.02,24.84 U2.5 | 53.65,32.01 v52.59,30.95 | 46.96,55.62 47.43,55.62 48.13,56.33 CAP7.1 48.37,56.33 49.07,55.62 50.72,55.62 51.42,56.33 CAP8.1 51.42,56.56 51.42,57.73 49.07,60.08 49.07,65.96 46.72,68.31 46.49,68.31 46.02,68.78 U3.5 | 46.96,55.62 45.55,55.62 44.84,56.33 CAP6.1 44.61,56.56 44.61,57.27 41.79,60.08 41.79,71.83 40.85,72.77 U$5.GND6 | v46.96,47.4 46.49,46.93 46.02,46.93 U4.5 | 46.96,55.62 v46.96,54.68 | v57.76,52.57 58.47,52.57 R3-8.2K2.1 | v57.76,74.42 58.47,74.42 R3-8.2K1.1 | v57.76,30.95 57.76,30.72
  Bottom 0.381: J4.10 14.77,64.08 14.77,57.73 13.83,56.8 13.83,47.4 14.77,46.46 J3.10 | v46.96,24.37 49.07,26.49 49.07,29.31 50.48,30.72 52.36,30.72 v52.59,30.95 | v46.96,54.68 v46.96,47.4 46.96,47.16 41.08,41.29 39.67,41.29 29.57,31.19 25.11,31.19 22.29,28.37 15,28.37 J2.10 | 48.48,65.14 40.85,72.77 U$5.GND6 | 48.48,65.14 57.76,55.85 v57.76,52.57 v57.76,30.95 | 48.48,65.14 v57.76,74.42
N$31  (via drill 0.2)
  Top 0.381: v43.2,13.8 43.2,12.39 44.37,11.22 44.37,7.22 Q8.3
  Route2 0.381: v43.2,13.8 43.2,56.8 40.85,59.15 32.39,59.15 28.86,62.67 25.58,62.67 U$5.4-BCLK2
N$32  (via drill 0.2)
  Top 0.381: v49.78,60.79 52.13,58.44 53.06,58.44 54.94,56.56 CAP9.1 | v44.84,65.72 45.31,65.72 45.78,66.19 U3.7 | v32.16,61.96 32.16,61.02 27.69,56.56 25.11,56.56 22.52,53.98 22.52,53.51 Q5.2
  Bottom 0.381: v49.78,60.79 46.72,63.84 46.72,64.08 45.08,65.72 v44.84,65.72 43.2,64.08 34.27,64.08 v32.16,61.96
N$33  (via drill 0.2)
  Top 0.381: v34.27,38.7 34.27,29.07 33.56,28.37 33.56,9.8 32.62,8.87 32.62,7.22 Q6.3
  Bottom 0.381: v34.27,38.7 34.27,48.34 34.5,48.57 34.5,49.04 26.05,57.5 25.58,57.5 U$5.6-OUT1D
N$34  (via drill 0.2)
  Top 0.381: v54.24,11.69 54.94,12.39 CAP4.1 | v52.36,13.56 47.66,18.26 47.66,20.85 46.02,22.49 U2.7 | v35.91,11.69 34.74,11.69 Q1.2
  Bottom 0.381: v52.36,13.56 52.48,13.45 | 52.48,13.45 v54.24,11.69 | v35.91,11.69 47.66,11.69 49.31,13.33 52.36,13.33 52.48,13.45
N$35
  Bottom 0.381: U$5.10-CS\MQSR 25.34,47.4 22.29,47.4 11.48,36.59 11.48,15.91 4.43,8.87 E-STOP.2
N$36
  Top 0.381: J4.6 15,69.25 16.41,67.84 16.41,67.6 17.35,66.66 18.06,66.66 19.7,65.02 19.7,64.55 20.17,64.08 26.75,64.08 28.16,62.67 32.39,62.67 33.09,61.96 33.09,48.57 39.2,42.46 U$5.13-SCK/LED
N$37
  Top 0.381: LED-HEADER.1 13.83,3.23 14.53,3.23 15.71,4.4 17.35,4.4 18.53,3.23 LED-HEADER.3 18.76,3.23 19.94,4.4 21.58,4.4 22.76,3.23 23.7,3.23 LED-HEADER.5 | U$5.GND1 25.34,75.36 18.76,75.36 18.06,74.65 16.41,74.65 15.47,75.59 14.53,75.59 2.79,63.84 2.79,13.8 4.2,12.39 E-STOP.1
  Bottom 0.381: LED-HEADER.1 13.59,3.23 9.36,3.23 5.37,7.22 3.73,7.22 2.79,8.16 2.79,10.74 4.2,12.16 E-STOP.1
N$38
  Bottom 0.381: U$5.20-A6/TX5/LRCLK1 40.85,60.08 44.84,60.08 53.77,51.16 53.77,33.3 51.66,31.19 48.84,31.19 41.08,23.43 37.32,23.43 22.52,8.63 22.52,7.46 19.47,4.4 17.59,4.4 16.41,3.23 LED-HEADER.2
N$39
  Top 0.381: J3.8 14.77,48.81 14.77,47.63 13.36,46.22 13.36,32.36 14.77,30.95 J2.8 14.77,30.72 14.77,29.78 13.83,28.84 13.83,24.37 15.71,22.49 15.71,18.97 15,18.26 12.18,18.26 11.48,17.56 R50-1.8K.2 11.24,17.56 10.3,18.5 9.13,18.5 8.66,18.03 8.66,16.85 11.24,14.27 11.24,13.56 R51-1.2K.2 11.24,13.33 11.24,4.64 8.42,1.82 7.48,1.82 6.31,2.99 5.61,2.99 12-5V.2 | 44.25,72.65 45.31,73.71 45.78,73.71 U3.1 46.02,73.95 50.95,73.95 U3.16 51.19,73.71 51.66,73.71 52.36,73.01 52.36,72.77 54,71.13 54.47,71.13 T2.1 54.71,70.89 54.71,68.78 63.17,60.32 63.17,53.74 56.47,47.05 | 44.25,72.65 43.67,72.07 43.67,58.91 44.14,58.44 44.37,58.44 46.25,56.56 CAP6.2 | 44.25,72.65 41.55,75.36 40.85,75.36 U$5.VIN | CAP1.2 46.25,12.62 44.37,14.5 44.14,14.5 43.67,14.97 43.67,28.13 45.31,29.78 45.78,29.78 U2.1 46.02,29.78 50.95,29.78 U2.16 51.19,29.78 51.66,29.78 52.36,29.07 52.36,28.13 53.3,27.19 54.47,27.19 T1.1 54.71,27.19 58.7,27.19 63.17,31.66 63.17,40.35 56.47,47.05 | CAP11.2 46.25,34.71 44.37,36.59 43.9,36.59 43.67,36.82 43.67,50.22 45.31,51.86 45.78,51.86 U4.1 46.02,52.1 50.95,52.1 U4.16 51.19,51.86 51.66,51.86 52.36,51.16 52.36,50.92 53.06,50.22 53.3,50.22 54.47,49.04 T3.1 54.71,48.81 56.47,47.05
  Route15 0.381: J4.8 15,66.9 15,67.6 16.65,69.25 26.75,69.25 30.98,73.48 37.09,73.48 38.97,75.36 40.61,75.36 U$5.VIN
  Bottom 0.381: J4.8 14.77,66.66 14.77,65.72 13.36,64.31 13.36,46.46 14.77,45.05 15.24,45.05 16.18,45.99 16.18,47.63 15,48.81 J3.8
N$40
  Bottom 0.381: U$5.21-A7/RX5/BCLK1 40.85,62.67 42.96,62.67 54.24,51.39 54.24,28.13 38.5,12.39 32.62,12.39 24.64,4.4 22.52,4.4 21.35,3.23 LED-HEADER.4
N$41
  Route15 0.381: U$5.38-A14/CS/IN1 40.61,29.54 40.61,28.84 27.46,15.68 27.46,4.17 26.52,3.23 LED-HEADER.6
N$42
  Bottom 0.381: J4.4 15,71.83 16.41,70.42 16.41,70.19 17.35,69.25 17.82,69.25 24.17,62.9 24.17,62.43 25.11,61.49 25.81,61.49 27.22,60.08 27.22,58.44 40.61,45.05 U$5.14-A0/TX3/SPDIF_OUT
N$43
  Bottom 0.381: J4.2 15,74.42 16.41,73.01 16.41,72.77 17.35,71.83 17.82,71.83 24.17,65.49 24.17,64.78 24.87,64.08 25.81,64.08 27.22,62.67 27.22,61.02 28.16,60.08 28.86,60.08 40.61,48.34 40.61,47.63 U$5.15-A1/RX3/SPDIF_IN
N$44
  Bottom 0.381: J4.1 17.59,75.59 18.53,75.59 25.11,69.01 25.81,69.01 27.22,67.6 27.22,66.19 28.16,65.25 28.86,65.25 31.45,62.67 31.45,61.73 37.79,55.38 40.61,55.38 U$5.18-A4/SDA0
N$45
  Route2 0.381: J3.6 15,51.39 16.41,52.8 16.41,53.04 17.35,53.98 37.09,53.98 40.61,57.5 U$5.19-A5/SCL0
N$46  (via drill 0.2)
  Top 0.381: v33.8,48.81 33.8,54.92 39.44,60.55 39.44,64.08 40.61,65.25 U$5.22-A8/CTX1
  Bottom 0.381: v33.8,48.81 28.86,53.74 15,53.74 J3.4
N$47
  Route15 0.381: J3.2 15,56.56 15,58.44 23.23,66.66 26.75,66.66 27.93,67.84 40.61,67.84 U$5.23-A9/CRX1/MCLK1
N$48  (via drill 0.2)
  Top 0.381: v18.76,20.38 18.76,29.78 17.82,30.72 17.35,30.72 16.41,31.66 16.41,33.53 15.94,34 15.94,35.41 16.18,35.65 16.18,36.36 15.94,36.59 15.94,37.76 16.18,38 16.18,55.38 17.35,56.56 17.35,57.5 J3.1
  Bottom 0.381: v18.76,20.38 21.58,20.38 25.34,24.14 25.34,24.61 U$5.29-TX7
N$49
  Top 0.381: U$5.31-CTX3 25.58,19.44 25.58,18.5 26.52,17.56 26.52,8.16 EXTRA.6
N$50
  Top 0.381: CAP15.2 60.35,34.71 57.76,37.29 54.94,37.29 R1-1K2.2 54.71,37.53 54.71,41.05 51.66,44.11 51.19,44.11 U4.10
N$51  (via drill 0.2)
  Top 0.381: 51.54,42.58 51.19,42.93 U4.9 | 51.54,42.58 54,40.11 54,36.82 54.24,36.59 56.59,36.59 58.47,34.71 CAP15.1 | v23.23,18.97 22.52,18.26 22.52,17.56 Q17.2 | v46.96,38.47 47.43,38.47 51.54,42.58
  Bottom 0.381: v23.23,18.97 25.11,20.85 26.05,20.85 34.27,29.07 34.27,30.01 40.38,36.12 44.61,36.12 v46.96,38.47
N$52
  Top 0.381: S1.P 14.3,19.44 7.48,19.44 4.43,22.49 POWER-IN.1
N$53
  Bottom 0.381: U$5.GND3 40.61,39.88 38.97,39.88 29.1,30.01 29.1,29.31 25.58,25.78 22.29,25.78 18.76,22.26 14.53,22.26 S1.S
N$54
  Top 0.381: POWER-IN.2 4.2,18.97 9.6,13.56 R51-1.2K.1 9.6,13.33 8.19,11.92 8.19,3.23 12-5V.3
N$55  (via drill 0.2)
  Top 0.381: v46.96,36.12 48.84,38 51.89,38 52.36,37.53 53.06,37.53 R1-1K2.1 | v23.23,12.39 22.29,11.45 Q18.2
  Bottom 0.381: v46.96,36.12 46.96,34.48 40.85,28.37 40.14,28.37 37.09,25.31 37.09,24.84 24.64,12.39 v23.23,12.39
N$56  (via drill 0.2)
  Top 0.381: v26.52,35.89 26.52,28.37 25.58,27.43 U$5.28-RX7
  Bottom 0.381: v26.52,35.89 26.52,37.76 25.81,38.47 25.11,38.47 23.93,39.64 17.59,39.64 J2.1
N$57
  Top 0.381: R50-1.8K.1 9.83,17.32 10.54,16.62 14.06,16.62 14.3,16.85 S1.O
N$58  (via drill 0.2)
  Top 0.381: R2-1K2.2 62.23,37.29 62.23,34.71 61.05,33.53 58,33.53 57.06,34.48 CAP14.2 56.83,34.48 55.89,33.53 v53.06,33.53 | v46.72,42.23 46.02,42.93 U4.8
  Bottom 0.381: v46.72,42.23 48.13,40.82 48.37,40.82 50.95,38.23 50.95,35.65 v53.06,33.53
N$59
  Route15 0.381: J2.6 15,33.53 24.17,33.53 25.34,34.71 U$5.25-A11/RX6/SDA2
N$60
  Bottom 0.381: J2.4 15,36.12 17.12,38.23 24.64,38.23 25.34,37.53 U$5.24-A10/TX6/SCL2
N$61  (via drill 0.2)
  Top 0.381: v53.06,45.05 60.58,37.53 R2-1K2.1 | v33.33,36.82 33.33,32.12 31.69,30.48 31.69,29.31 25.81,23.43 22.52,23.43 Q16.2
  Bottom 0.381: v53.06,45.05 53.06,45.52 47.66,50.92 47.66,54.92 47.19,55.38 46.72,55.38 43.2,51.86 43.2,44.11 42.73,43.64 40.14,43.64 v33.33,36.82
N$62
  Top 0.381: U$5.30-CRX3 25.34,22.02 25.34,21.08 23.93,19.67 23.93,8.16 EXTRA.5
N$63
  Bottom 0.381: J2.2 15,38.47 16.41,39.88 16.41,40.11 18.53,42.23 25.34,42.23 U$5.12-MISO/MQSL
N$64  (via drill 0.2)
  Top 0.381: v52.59,35.41 53.3,34.71 CAP13.2 | v48.37,43.4 46.02,45.75 U4.6
  Bottom 0.381: v52.59,35.41 52.59,39.17 v48.37,43.4
N$65  (via drill 0.2)
  Top 0.381: R4-20K2.2 46.25,37.53 46.25,41.05 44.61,42.7 44.61,47.16 45.78,48.34 U4.4 46.02,48.34 46.49,48.34 v48.84,50.69 | v50.72,53.27 50.95,53.51 59.41,53.51 60.35,52.57 R3-8.2K2.2
  Bottom 0.381: v50.72,53.27 48.84,51.39 v48.84,50.69
N$66  (via drill 0.2)
  Top 0.381: v54.94,49.98 55.42,50.45 55.42,50.92 T3.3 | v44.61,49.98 45.08,50.45 45.78,50.45 U4.2
  Route2 0.381: v44.61,49.98 v54.94,49.98
N$67
  Top 0.381: U4.14 51.19,49.51 51.19,50.45 U4.15
N$68  (via drill 0.2)
  Top 0.381: CAP12.2 49.78,34.71 49.07,35.41 46.72,35.41 44.84,37.29 R4-20K2.1 44.61,37.53 44.61,41.99 44.14,42.46 44.14,48.1 45.31,49.28 45.78,49.28 U4.3 46.02,49.28 48.13,51.39 v49.78,51.39 | v51.19,52.8 51.89,52.8 53.53,51.16 T3.2
  Bottom 0.381: v49.78,51.39 v51.19,52.8
N$69  (via drill 0.2)
  Top 0.381: v39.44,36.59 39.44,12.62 35.44,8.63 35.21,8.63 34.74,8.16 Q6.2 | v47.9,44.81 48.84,44.81 50.95,46.93 U4.12
  Bottom 0.381: v39.44,36.59 39.44,37.76 40.38,38.7 41.79,38.7 v47.9,44.81
N$70  (via drill 0.2)
  Top 0.381: v41.79,25.08 41.79,16.62 40.61,15.44 40.61,8.16 Q7.2 | v48.13,40.11 48.13,42.23 50.01,44.11 50.01,44.81 50.95,45.75 U4.11
  Bottom 0.381: v41.79,25.08 41.79,26.02 48.13,32.36 v48.13,40.11
N$71
  Bottom 0.381: U$5.41-A17/MISO1 40.85,37.53 45.08,37.53 46.72,39.17 47.19,39.17 47.66,38.7 47.66,32.59 40.85,25.78 38.97,25.78 21.35,8.16 EXTRA.4
N$72
  Bottom 0.381: U$5.40-A16/CS1 40.61,34.71 40.61,34 36.62,30.01 36.62,25.08 24.64,13.09 22.99,13.09 18.76,8.87 18.76,8.16 EXTRA.3
N$73  (via drill 0.2)
  Top 0.381: v19.47,23.9 19.47,11.22 16.41,8.16 EXTRA.2
  Bottom 0.381: v19.47,23.9 19.7,23.9 25.34,29.54 U$5.27-A13/SCK1
N$74  (via drill 0.2)
  Top 0.381: v51.66,37.29 52.36,36.59 53.06,36.59 54.94,34.71 CAP14.1 | v47.43,43.17 46.49,44.11 46.02,44.11 U4.7 | v41.79,39.64 41.79,38.94 41.55,38.7 39.67,38.7 38.97,39.41 34.03,39.41 29.33,34.71 29.33,29.54 25.81,26.02 24.87,26.02 22.52,28.37 22.52,29.31 Q15.2
  Bottom 0.381: v51.66,37.29 51.66,38.94 47.54,43.05 | v47.43,43.17 47.54,43.05 | v41.79,39.64 47.66,45.52 48.13,45.52 48.6,45.05 48.6,44.58 47.66,43.64 47.66,43.17 47.54,43.05
N$75
  Bottom 0.381: U$5.26-A12/MOSI1 25.34,32.36 21.35,32.36 17.82,35.89 16.41,35.89 15,34.48 14.53,34.48 12.18,32.12 12.18,9.57 13.59,8.16 EXTRA.1
N$76  (via drill 0.2)
  Top 0.381: v21.35,21.08 21.35,19.67 Q17.3
  Bottom 0.381: v21.35,21.08 15.24,21.08 15,20.85 13.83,20.85 13.12,21.55 13.12,27.9 15,29.78 15.47,29.78 17.59,31.89 J2.7
N$77
  Top 0.381: Q16.3 21.58,25.78 21.58,30.25 21.35,30.48 20.88,30.48 19,32.36 19,33.06 17.59,34.48 J2.5
N$78
  Top 0.381: Q15.3 21.35,31.66 21.35,32.83 17.59,36.59 17.59,37.06 J2.3
N$79
  Top 0.381: Q13.3 21.35,43.64 21.35,44.81 18.53,47.63 18.53,49.04 17.59,49.98 J3.7
N$80
  Top 0.381: Q12.3 21.35,49.75 20.41,49.75 17.59,52.57 J3.5
N$81  (via drill 0.2)
  Top 0.381: v20.64,14.5 21.35,13.8 Q18.3
  Bottom 0.381: v20.64,14.5 15.24,14.5 12.65,17.09 12.65,30.01 14.77,32.12 15.94,32.12 17.12,33.3 17.82,33.3 18.53,32.59 18.53,30.72 17.59,29.78 J2.9
N$82
  Top 0.381: Q5.3 21.35,55.38 17.59,55.38 J3.3
N$83
  Top 0.381: Q3.3 21.35,67.6 18.06,67.6 17.59,68.07 J4.7
N$84
  Top 0.381: Q2.3 21.35,73.48 20.41,73.48 17.59,70.66 J4.5
N$85  (via drill 0.2)
  Top 0.381: v27.46,16.85 32.39,11.92 Q1.3 | v13.36,20.14 13.36,21.32 12.89,21.79 12.89,71.36 14.53,73.01 17.35,73.01 J4.3
  Bottom 0.381: v27.46,16.85 26.05,18.26 14.06,18.26 13.12,19.2 13.12,19.91 v13.36,20.14
N$86  (via drill 0.2)
  Top 0.381: v24.17,45.52 24.17,40.35 21.58,37.76 Q14.3
  Bottom 0.381: v24.17,45.52 25.11,46.46 26.05,46.46 26.52,46.93 26.52,48.1 25.81,48.81 18.76,48.81 17.59,47.63 J3.9
N$90
  Top 0.381: Q4.3 21.35,61.73 17.59,65.49 J4.9